# EAGLE design PERF-METER (EAGLE 9.5.0)
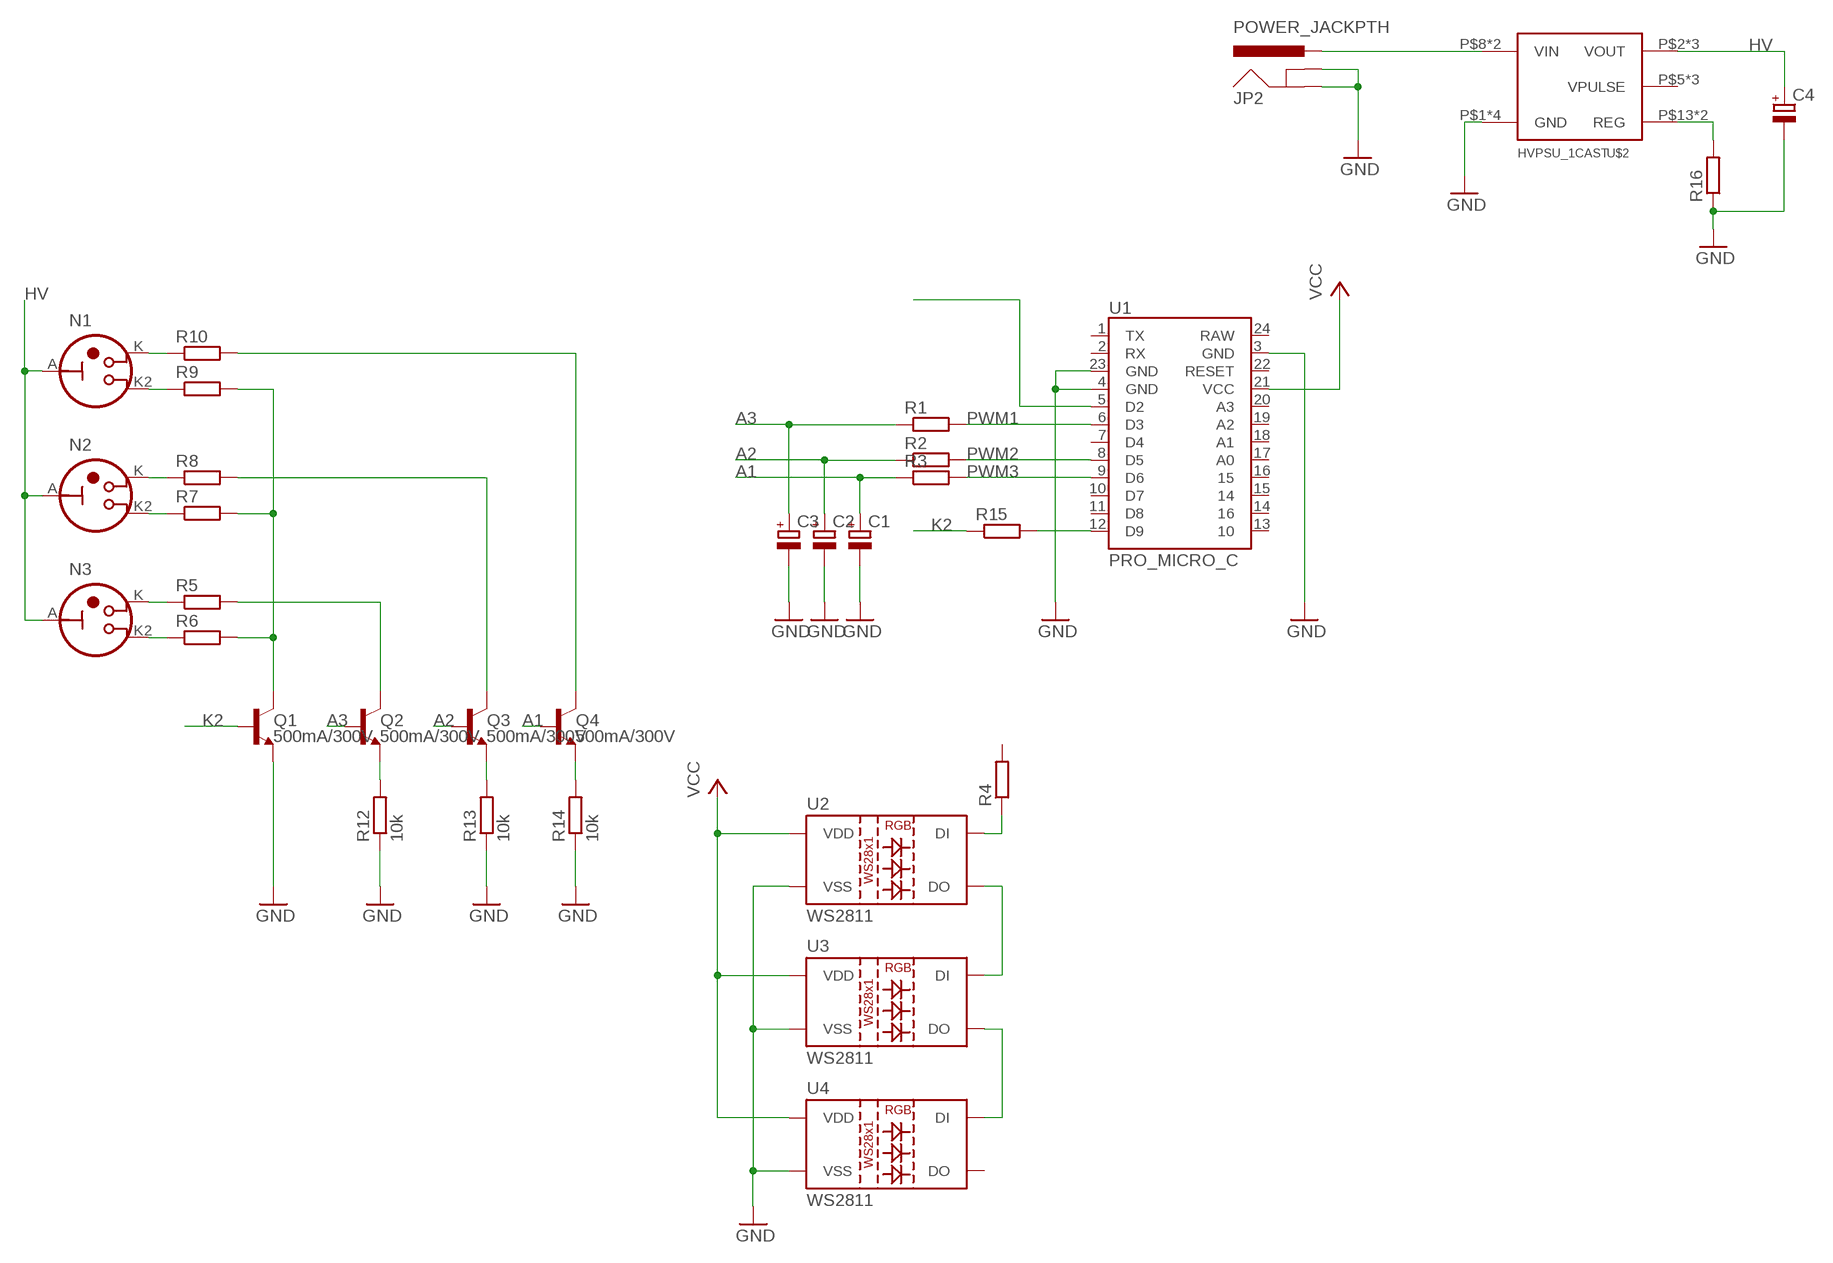
[diagram p0: schematic, sheet 1]

## Parts
C1  CPOL-EUE2-4  [E2-4]
C2  CPOL-EUE2-4  [E2-4]
C3  CPOL-EUE2-4  [E2-4]
C4  CPOL-EUE2-4  [E2-4]
JP2  POWER_JACKPTH  [POWER_JACK_PTH]
N1  IN-13  [IN-13]
N2  IN-13  [IN-13]
N3  IN-13  [IN-13]
Q1  500mA/300V  TRANS_NPN-MMBTA42  [SOT23-3]
Q2  500mA/300V  TRANS_NPN-MMBTA42  [SOT23-3]
Q3  500mA/300V  TRANS_NPN-MMBTA42  [SOT23-3]
Q4  500mA/300V  TRANS_NPN-MMBTA42  [SOT23-3]
R1  R-EU_R0805  [R0805]
R2  R-EU_R0805  [R0805]
R3  R-EU_R0805  [R0805]
R4  R-EU_R0805  [R0805]
R5  R-EU_0207/7  [0207/7]
R6  R-EU_0207/7  [0207/7]
R7  R-EU_0207/7  [0207/7]
R8  R-EU_0207/7  [0207/7]
R9  R-EU_0207/7  [0207/7]
R10  R-EU_0207/7  [0207/7]
R12  10k  R-EU_R0805  [R0805]
R13  10k  R-EU_R0805  [R0805]
R14  10k  R-EU_R0805  [R0805]
R15  R-EU_R0805  [R0805]
R16  R-EU_R0805  [R0805]
U1  PRO_MICRO_C  [PRO_MICRO_C]
U2  WS2811  LED-TRICOLOR-5050-ICWS2811  [LED-TRICOLOR-5050-IC]
U3  WS2811  LED-TRICOLOR-5050-ICWS2811  [LED-TRICOLOR-5050-IC]
U4  WS2811  LED-TRICOLOR-5050-ICWS2811  [LED-TRICOLOR-5050-IC]
U$2  HVPSU_1CAST  [HVPSU_CASTELATED]

## Nets
A1: C1.+ Q4.1(B) R3.1
A2: C2.+ Q3.1(B) R2.1
A3: C3.+ Q2.1(B) R1.1
GND: C1.- C2.- C3.- C4.- JP2.GND JP2.GNDBREAK Q1.2(E) R12.1 R13.1 R14.1 R16.1 U1.3(GND) U1.4(GND) U1.23(GND) U2.6(VSS) U3.6(VSS) U4.6(VSS) U$2.P$1(GND) U$2.P$10(GND) U$2.P$11(GND) U$2.P$12(GND)
HV: C4.+ N1.A N2.A N3.A U$2.P$2(VOUT) U$2.P$3(VOUT) U$2.P$4(VOUT)
K2: Q1.1(B) R15.1
N$1: R15.2 U1.12(D9)
N$2: R16.2 U$2.P$13(REG) U$2.P$14(REG)
N$3: U1.5(D2)
N$4: U2.1(DO) U3.2(DI)
N$5: JP2.PWR U$2.P$8(VIN) U$2.P$9(VIN)
N$6: U3.1(DO) U4.2(DI)
N$7: N1.K R10.1
N$8: N1.K2 R9.1
N$9: R4.1 U2.2(DI)
N$10: N2.K R8.1
N$11: N2.K2 R7.1
N$12: N3.K R5.1
N$13: N3.K2 R6.1
N$14: Q1.3(C) R6.2 R7.2 R9.2
N$15: Q3.3(C) R8.2
N$16: Q2.3(C) R5.2
N$17: Q4.3(C) R10.2
N$19: Q2.2(E) R12.2
N$20: Q3.2(E) R13.2
N$21: Q4.2(E) R14.2
PWM1: R1.2 U1.6(D3)
PWM2: R2.2 U1.8(D5)
PWM3: R3.2 U1.9(D6)
VCC: U1.21(VCC) U2.3(VDD) U2.5(VDD) U3.3(VDD) U3.5(VDD) U4.3(VDD) U4.5(VDD)
Unconnected: R4.2 U1.1(TX) U1.2(RX) U1.7(D4) U1.10(D7) U1.11(D8) U1.13 U1.14 U1.15 U1.16 U1.17(A0) U1.18(A1) U1.19(A2) U1.20(A3) U1.22(RESET) U1.24(RAW) U4.1(DO) U$2.P$5(VPULSE) U$2.P$6(VPULSE) U$2.P$7(VPULSE)

## Library data of the parts
C1-C4 = rcl:CPOL-EU: POLARIZED CAPACITOR, European symbol; SPICEPREFIX: C
JP2 = SparkFun-Connectors:POWER_JACK: Power Jack This is the standard 5.5mm barrel jack for power. The PTH is the most common, proven, reliable, footprint. The Slot footprint only works if the mill layer is transmitted to the PCB fab house so be warned. Mating wall wart : TOL-00298 (and others); PROD_ID: CONN-08197
N1-N3 = russian-nixies:IN-13: IN-13: large nixie bargraph
Q1-Q4 = SparkFun-DiscreteSemi:TRANS_NPN: NPN transistor Current controlled devices typically used to amplify current or used as a switch. BC547 - COM-08928 <http://www.sparkfun.com/products/8928> (TO-92 45V 100mA) (1.Collector 2.Base 3.Emitter) 2N3904 - COM-00521 <http://www.sparkfun.com/products/521> (TO-92 40V 200mA) (1.Emitter 2.Base 3.Collector) P2N2222A - COM-12852 <http://www.sparkfun.com/products/12852> (TO-92 40V 600mA) (1.Collector 2.Base 3.Emitter); PROD_ID: TRANS-09116
R1-R10 R12-R16 = rcl:R-EU_: RESISTOR, European symbol; SPICEPREFIX: R
U1 = SparkFun-Boards:PRO_MICRO_C
U2-U4 = SparkFun-LED:LED-TRICOLOR-5050-IC: WS2812 RGB LED w/ WS2811 driver 5x5mm SMD LED with built-in controller IC. DIO-11598; PROD_ID: DIO-11598
U$2 = FHD-Boards:HVPSU_1

## Board
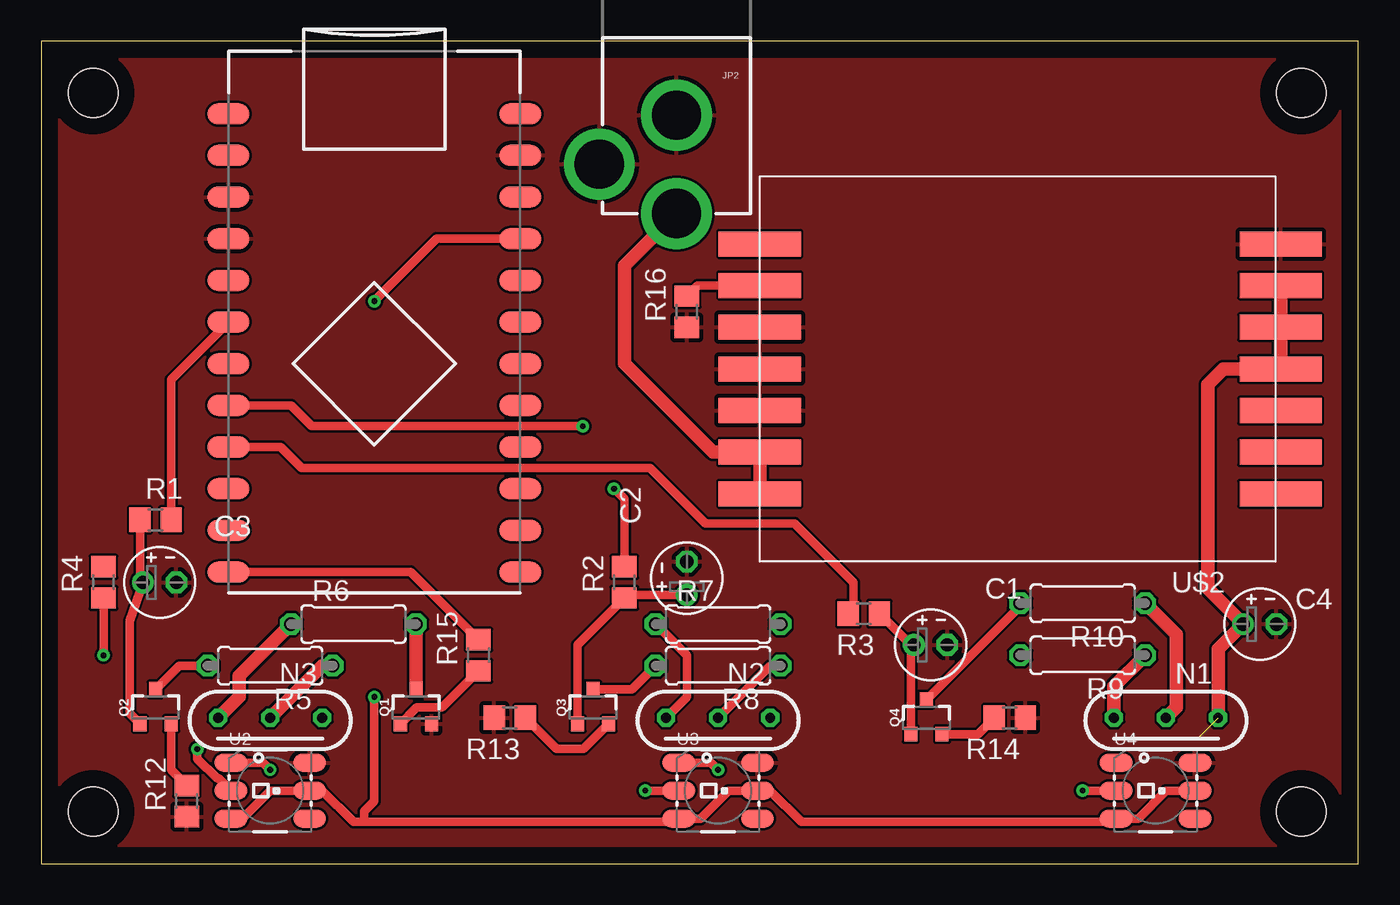
[diagram p1: board, top side]
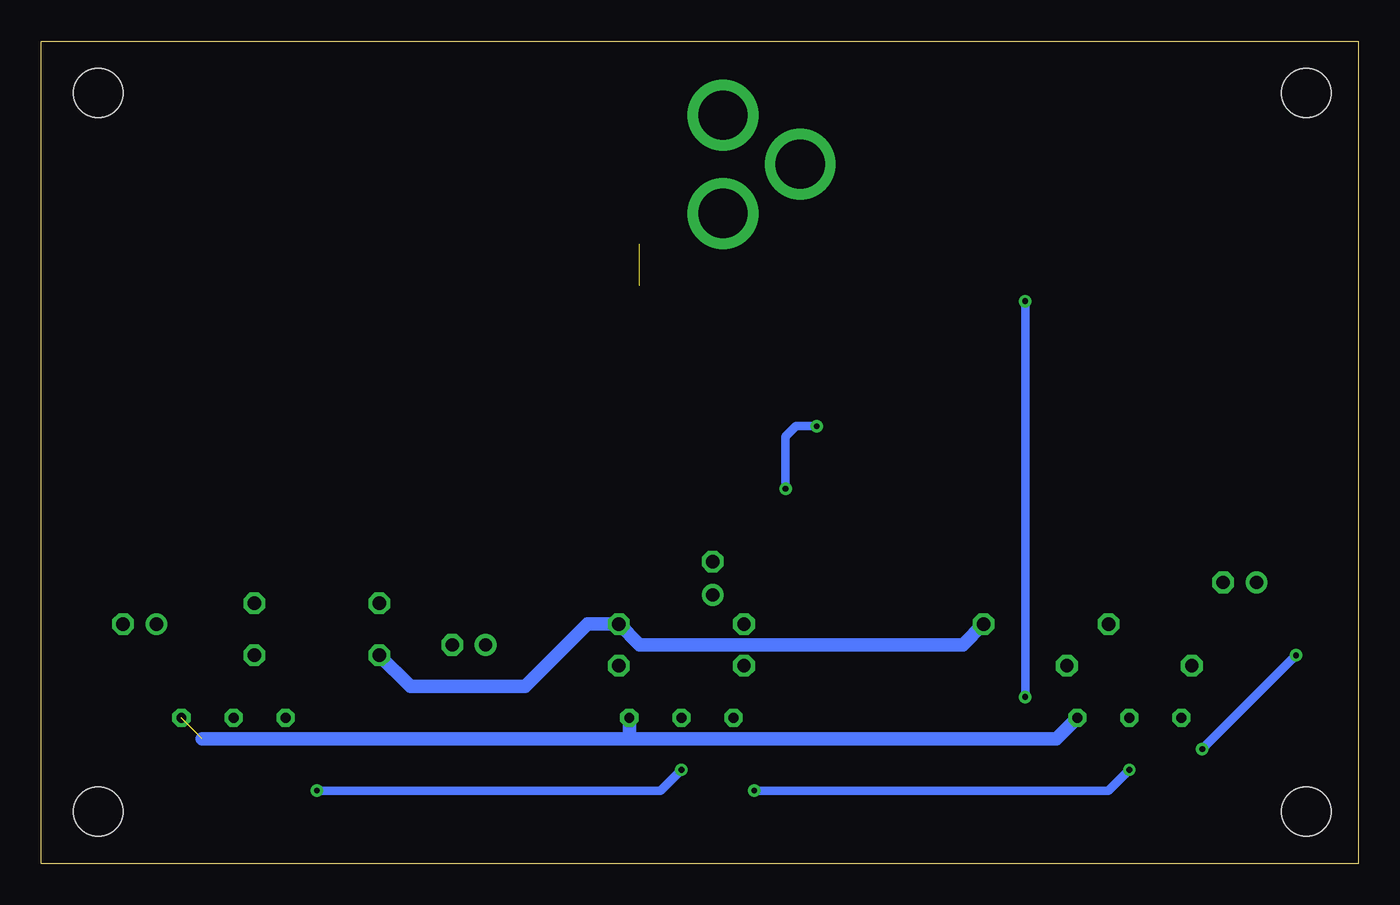
[diagram p2: board, bottom side, seen from below]

Size 80.31 x 50.16 mm. Coordinates in mm from the lower left corner, seen from the top.
Outline: 0,0 80.31,0 80.31,50.16 0,50.16 0,0
Copper layers (1*16): Top 0.035mm / dielectric 1.5mm / Bottom 0.035mm
Design rules "default": minimum track width 6mil, minimum drill 0.35mm, track to track 6mil, track to pad 6mil, pad to pad 6mil, via to via 6mil, smd to smd 6mil, copper to edge 40mil, drill to drill 6mil, minimum pad ring 10mil, minimum via ring 8mil, stop-mask expansion 4mil, vias tented up to drill 0mil, thermal gap 10mil
Holes 3 mm at 76.83,46.99 76.83,3.17 3.17,3.17 3.17,46.99

### Footprints (pad centres in the part's own frame; a part is rotated, then mirrored left to right if it is on the bottom)
E2-4 = drill 0.813 pad 1.27: + -1.016,0 | drill 0.813 pad 1.27 octagon: - 1.016,0
POWER_JACK_PTH = drill 2.997 pad 4.318: GND 0,7.7; GNDBREAK 4.7,10.7; PWR 0,13.7
IN-13 = drill 0.6 octagon: A 0,0; K 3.175,0; K2 6.35,0
SOT23-3 = smd 0.8 x 0.9: 1 -0.95,-1; 2 0.95,-1; 3 0,1.1
R0805 = smd 1.3 x 1.5: 1 -0.95,0; 2 0.95,0
0207/7 = drill 0.813 octagon: 1 -3.81,0; 2 3.81,0
PRO_MICRO_C = smd 2.54 x 1.27: 1 -8.89,12.7; 2 -8.89,10.16; 3 -8.89,7.62; 4 -8.89,5.08; 5 -8.89,2.54; 6 -8.89,0; 7 -8.89,-2.54; 8 -8.89,-5.08; 9 -8.89,-7.62; 10 -8.89,-10.16; 11 -8.89,-12.7; 12 -8.89,-15.24; 13 8.89,-15.24; 14 8.89,-12.7; 15 8.89,-10.16; 16 8.89,-7.62; 17 8.89,-5.08; 18 8.89,-2.54; 19 8.89,0; 20 8.89,2.54; 21 8.89,5.08; 22 8.89,7.62; 23 8.89,10.16; 24 8.89,12.7
LED-TRICOLOR-5050-IC = smd 2 x 1.1: 1 -2.4,1.7; 2 -2.4,0; 3 -2.4,-1.7; 4 2.4,-1.7; 5 2.4,0; 6 2.4,1.7
HVPSU_CASTELATED = smd 1.524 x 5: P$1 4.128,31.75; P$2 6.668,31.75; P$3 9.207,31.75; P$4 11.748,31.75; P$5 14.287,31.75; P$6 16.828,31.75; P$7 19.367,31.75; P$8 19.367,0; P$9 16.828,0; P$10 14.287,0; P$11 11.748,0; P$12 9.207,0; P$13 6.668,0; P$14 4.128,0

### Placement (x,y rotation side)
C1  54.23,13.33 0 top
C2  39.37,17.4 90 top
C3  7.24,17.14 0 top
C4  74.3,14.6 0 top
JP2  38.73,53.34 180 top
N1  71.75,8.89 180 top
N2  44.45,8.89 180 top
N3  17.14,8.89 180 top
Q1  22.86,9.52 0 top
Q2  6.99,9.52 0 top
Q3  33.66,9.52 0 top
Q4  53.98,8.89 0 top
R1  6.99,20.95 0 top
R2  35.56,17.14 90 top
R3  50.16,15.24 180 top
R4  3.81,17.14 90 top
R5  13.97,12.06 180 top
R6  19.05,14.6 0 top
R7  41.27,14.6 0 top
R8  41.27,12.06 180 top
R9  63.5,12.7 180 top
R10  63.5,15.88 180 top
R12  8.89,3.81 90 top
R13  28.57,8.89 0 top
R14  59.05,8.89 180 top
R15  26.67,12.7 90 top
R16  39.37,33.66 90 top
U1  20.32,33.02 0 top
U2  13.97,4.45 0 top
U3  41.27,4.45 0 top
U4  67.94,4.45 0 top
U$2  43.81,41.91 270 top

### Tracks (layer width: path | path; a pad name or v marks a point on that pad's centre or on a via)
A1
  Top 0.508: R3.1 53.02,13.33 C1.+ 53.02,13.15 Q4.1
A2
  Top 0.508: C2.+ 35.75,16.38 R2.1 32.7,13.34 Q3.1
A3
  Top 0.508: Q2.1 5.4,9.16 5.4,14.8 C3.+ 6.04,17.33 R1.1
GND
  pour Top: 0,-4.45 79.38,-4.45 79.38,63.5 0,63.5
HV  (1 unrouted)
  Top 0.813: U$2.P$2 U$2.P$3 U$2.P$4 72.07,30.16 71.12,29.21 71.12,16.76 C4.+ 71.75,13.08 N1.A
  Bottom 0.813: N3.A 18.41,7.62 44.45,7.62 | 70.48,7.62 44.45,7.62 | N2.A 44.45,7.62
K2
  Top 0.508: Q1.1 22.91,9.52 24.45,9.52 R15.1
N$1
  Top 0.508: U1.12 22.54,17.78 R15.2
N$2  (1 unrouted)
  Top 0.508: R16.2 40.01,35.24 U$2.P$13
N$4  (via drill 0.35)
  Top 0.508: U2.1 13.54,6.14 v13.97,5.71 | v36.83,4.45 U3.2
  Bottom 0.508: v13.97,5.71 15.24,4.45 v36.83,4.45
N$5
  Top 0.813: U$2.P$8 U$2.P$9 40.96,25.08 35.56,30.48 35.56,36.46 JP2.PWR
N$6  (via drill 0.35)
  Top 0.508: U3.1 40.84,6.14 v41.27,5.71 | v63.5,4.45 U4.2
  Bottom 0.508: v41.27,5.71 42.55,4.45 v63.5,4.45
N$7
  Top 0.813: N1.K 69.22,9.52 69.22,13.97 R10.1
N$8
  Top 0.813: N1.K2 65.41,10.79 R9.1
N$9  (via drill 0.35)
  Top 0.508: 11.19,4.45 U2.2 10.83,5.19 10.72,5.19 9.53,6.39 v9.53,6.98 | v3.81,12.7 R4.1
  Bottom 0.508: v9.53,6.98 v3.81,12.7
N$10
  Top 0.508: N2.K 44.45,12.06 R8.1
N$11
  Top 0.508: R7.1 39.37,12.7 39.37,10.16 N2.K2
N$12
  Top 0.813: N3.K 17.14,12.06 R5.1
N$13
  Top 0.813: N3.K2 12.06,10.16 12.06,11.43 R6.1
N$14
  Top 0.813: Q1.3 R6.2
  Bottom 0.813: R9.2 57.78,10.79 50.8,10.79 46.99,14.6 R7.2 43.81,13.33 24.13,13.33 R6.2
N$15
  Top 0.508: Q3.3 36.02,10.62 R8.2
N$16
  Top 0.508: R5.2 8.43,12.06 Q2.3
N$17
  Top 0.508: Q4.3 59.69,15.7 R10.2
N$19
  Top 0.508: R12.2 7.93,5.71 Q2.2
N$20
  Top 0.508: R13.2 31.43,6.98 33.06,6.98 Q3.2
N$21
  Top 0.508: Q4.2 57.1,7.89 R14.2
PWM1
  Top 0.508: U1.6 7.93,29.52 R1.2
PWM2  (via drill 0.35)
  Top 0.508: v33.02,26.67 16.51,26.67 15.24,27.94 U1.8 | v34.92,22.86 35.56,22.23 R2.2
  Bottom 0.508: v33.02,26.67 34.29,26.67 34.92,26.03 v34.92,22.86
PWM3
  Top 0.508: R3.2 49.53,15.55 49.53,17.14 45.94,20.74 40.51,20.74 37.12,24.13 15.88,24.13 14.61,25.4 U1.9
VCC  (via drill 0.35)
  Top 0.508: U2.3 12.27,2.74 13.97,4.45 U2.5 17.14,4.45 19.05,2.54 19.68,2.54 | 19.68,2.54 38.67,2.54 U3.3 40.21,2.74 41.91,4.45 U3.5 44.45,4.45 46.35,2.54 65.34,2.54 U4.3 66.88,2.74 68.58,4.45 U4.5 | 19.68,2.54 19.68,3.17 20.32,3.81 v20.32,10.16 | v20.32,34.29 24.13,38.1 U1.21
  Bottom 0.508: v20.32,34.29 v20.32,10.16